# EAGLE design 12A-02 (EAGLE 6.3)
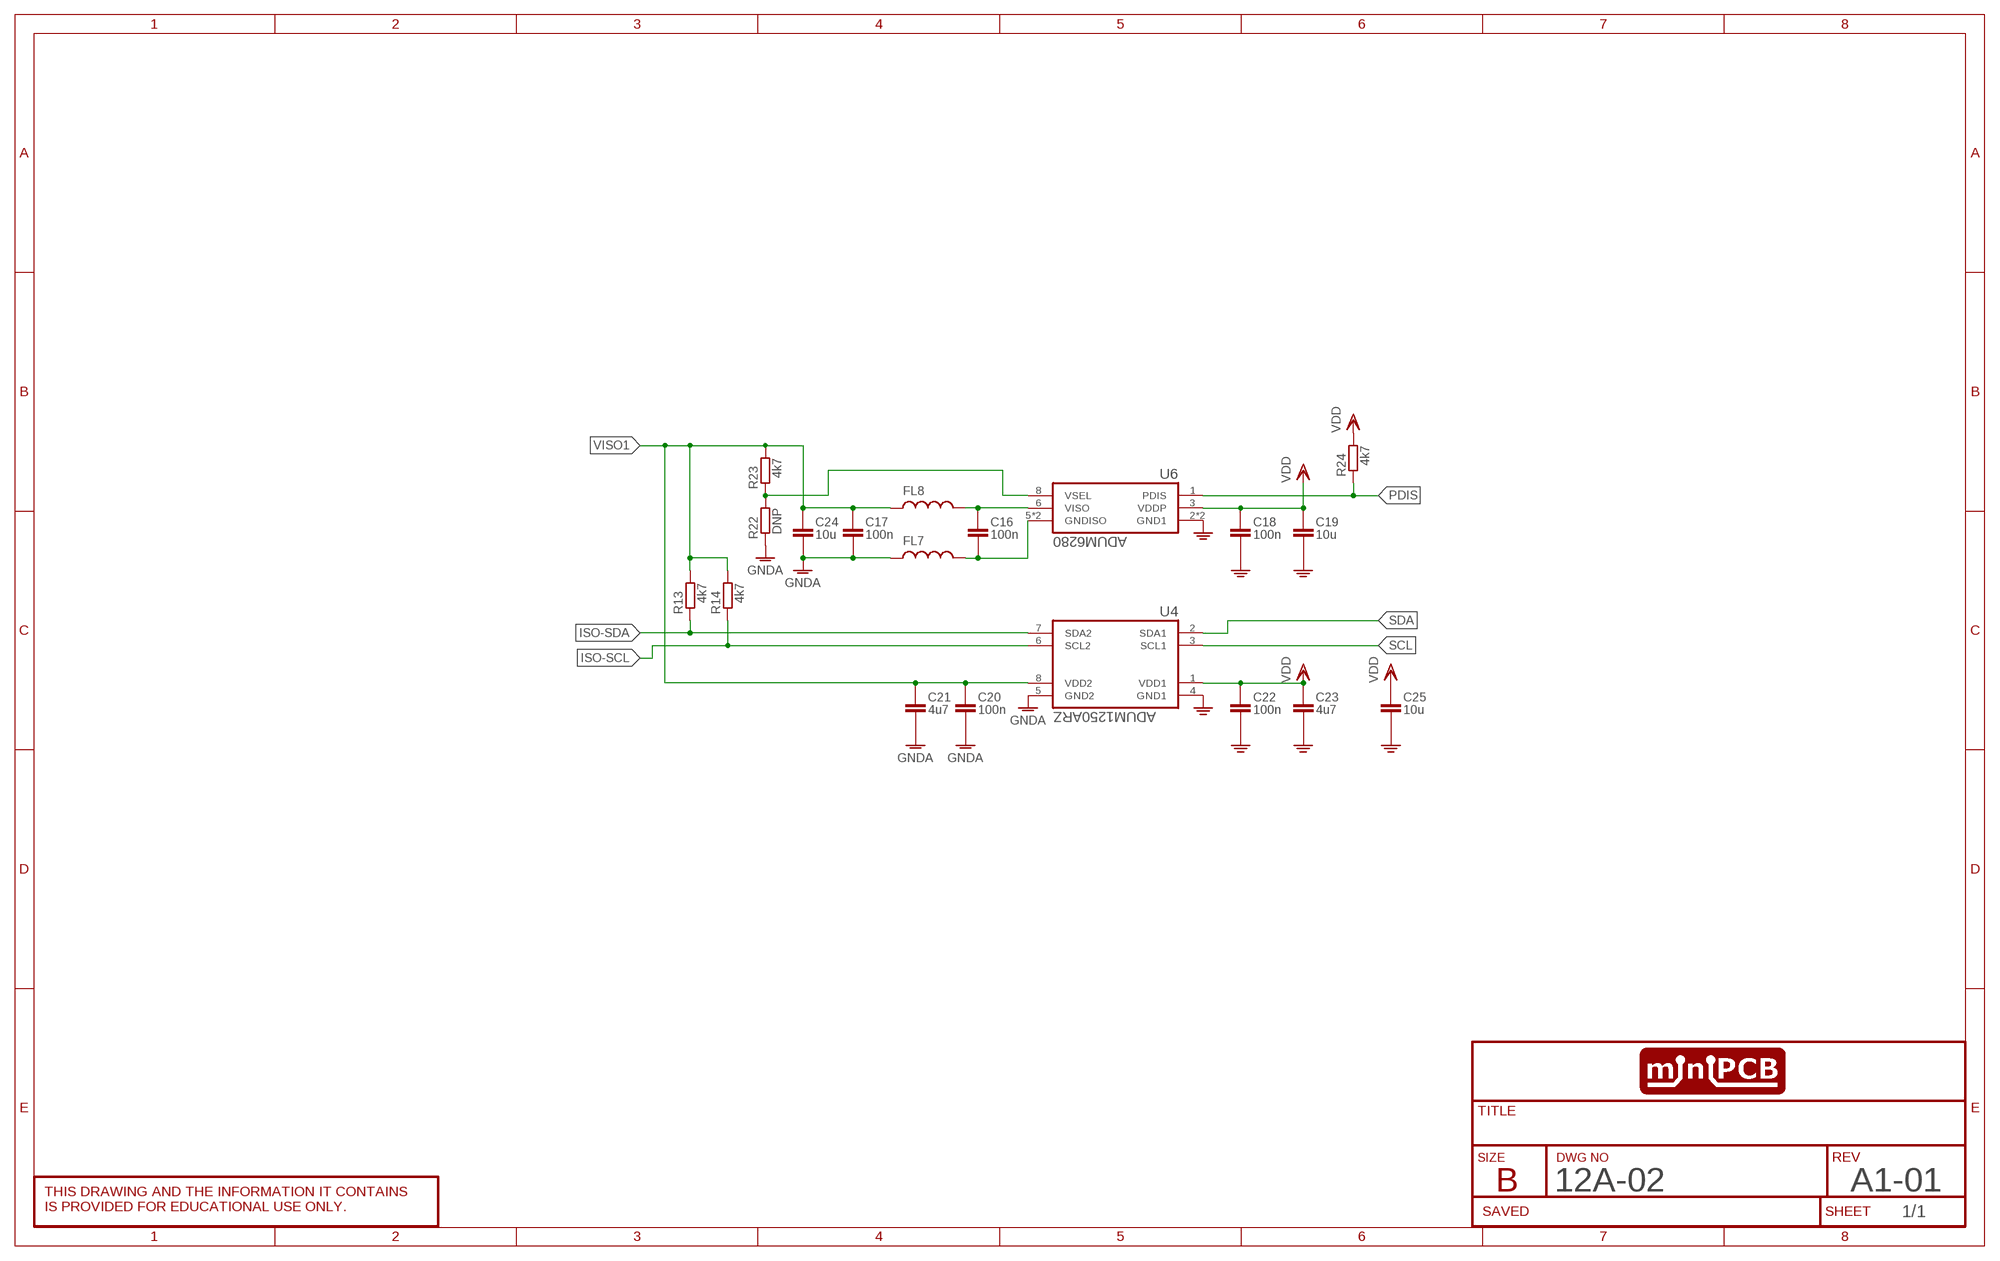
[diagram p0: schematic, sheet 1]
SHEET1 (SCHEMATIC): REV: A1-01

## Parts
C16  100n  CAPACITOR0402  [C0402]
C17  100n  CAPACITOR0402  [C0402]
C18  100n  CAPACITOR0402  [C0402]
C19  10u  CAPACITORSMD  [C0805]
C20  100n  CAPACITOR0402  [C0402]
C21  4u7  CAPACITOR0402  [C0402]
C22  100n  CAPACITOR0402  [C0402]
C23  4u7  CAPACITOR0402  [C0402]
C24  10u  CAPACITORSMD  [C0805]
C25  10u  CAPACITORSMD  [C0805]
FL7  BLM03HG601SZ1D  [R0402]
FL8  BLM03HG601SZ1D  [R0402]
R13  4k7  RESISTOR0402  [R0402]
R14  4k7  RESISTOR0402  [R0402]
R22  DNP  RESISTOR0402  [R0402]
R23  4k7  RESISTOR0402  [R0402]
R24  4k7  RESISTOR0402  [R0402]
U4  ADUM1250ARZ  [SOIC127P600X175-8N]
U6  ADUM6280  [SOIC127P600X175-8N]

## Nets
GND: C18.2(-) C19.2ASDF(-) C22.2(-) C23.2(-) C25.2ASDF(-) U4.4(GND1) U6.2(GND1) U6.4(GND1)
GNDA: C17.2(-) C20.2(-) C21.2(-) C24.2ASDF(-) FL7.1 R22.1 U4.5(GND2)
ISO-SCL: R14.1 U4.6(SCL2)
ISO-SDA: R13.1 U4.7(SDA2)
N$22: R22.2 R23.1 U6.8(VSEL)
N$23: C16.2(-) FL7.2 U6.5(GNDISO) U6.7(GNDISO)
N$24: C16.1(+) FL8.2 U6.6(VISO)
PDIS: R24.1 U6.1(PDIS)
SCL: U4.3(SCL1)
SDA: U4.2(SDA1)
VDD: C18.1(+) C19.1ASD(+) C22.1(+) C23.1(+) C25.1ASD(+) R24.2 U4.1(VDD1) U6.3(VDDP)
VISO1: C17.1(+) C20.1(+) C21.1(+) C24.1ASD(+) FL8.1 R13.2 R14.2 R23.2 U4.8(VDD2)

## Library data of the parts
C16-C25 = minipcb:CAPACITOR
FL7 FL8 = minipcb:BLM03HG601SZ1D: Check availability <https://pricing.snapeda.com/parts/BLM03HG601SZ1D/Murata/view-part?ref=eda>
R13 R14 R22-R24 = minipcb:RESISTOR
U4 = 16A-01:ADUM1250ARZ: Hot Swappable, Dual I2C Isolators Check availability <https://pricing.snapeda.com/parts/ADUM1250ARZ/Analog%20Devices/view-part?ref=eda>; AVAILABILITY: In Stock; CHECK_PRICES: https://www.snapeda.com/parts/ADUM1250ARZ/Analog+Devices/view-part/?ref=eda; DESCRIPTION: Hot Swappable Dual I2C Isolator; MF: Analog Devices; MP: ADUM1250ARZ; PACKAGE: SOIC-8 Analog Devices; PRICE: None; SNAPEDA_LINK: https://www.snapeda.com/parts/ADUM1250ARZ/Analog+Devices/view-part/?ref=snap
U6 = 16A-01:ADUM6280

## Board
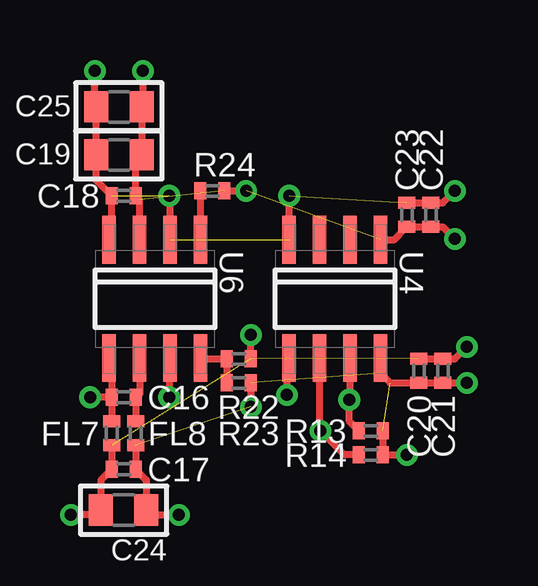
[diagram p1: board, top side]
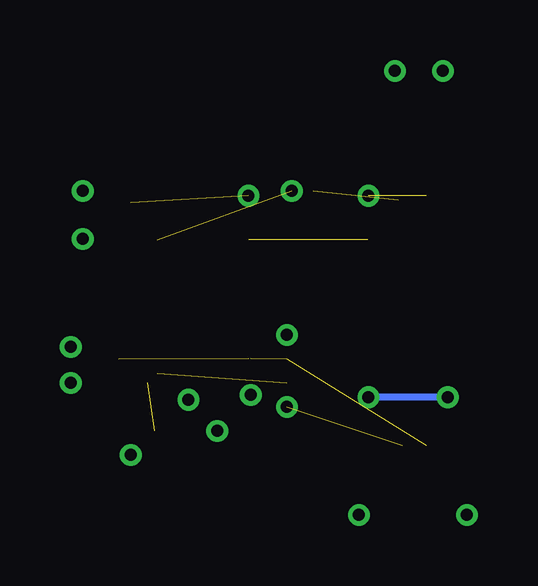
[diagram p2: board, bottom side, seen from below]

No outline drawn. Coordinates in mm, seen from the top.
Copper layers (1*16): Top 0.035mm / dielectric 1.5mm / Bottom 0.035mm
Design rules "default": minimum track width 10mil, minimum drill 0.6mm, track to track 8mil, track to pad 8mil, pad to pad 8mil, via to via 8mil, smd to smd 8mil, copper to edge 40mil, drill to drill 8mil, minimum pad ring 10mil, minimum via ring 8mil, stop-mask expansion 4mil, vias tented up to drill 0mil, thermal gap 10mil

### Footprints (pad centres in the part's own frame; a part is rotated, then mirrored left to right if it is on the bottom)
C0402 = smd 0.5 x 0.7: 1 -0.5,0; 2 0.5,0
C0805 = smd 1 x 1.3: 1ASD -0.95,0; 2ASDF 0.95,0
R0402 = smd 0.5 x 0.7: 1 -0.5,0; 2 0.5,0
SOIC127P600X175-8N = smd 1.981 x 0.559: 1 -2.464,1.905; 2 -2.464,0.635; 3 -2.464,-0.635; 4 -2.464,-1.905; 5 2.464,-1.905; 6 2.464,-0.635; 7 2.464,0.635; 8 2.464,1.905

### Placement (x,y rotation side)
C16  -8.8,-4.1 180 top
C17  -8.8,-7.1 180 top
C18  -8.8,4.3 180 top
C19  -9,6 180 top
C20  3.5,-3 90 top
C21  4.5,-3 90 top
C22  4,3.5 90 top
C23  3,3.5 90 top
C24  -8.8,-8.8 180 top
C25  -9,8 180 top
FL7  -9.3,-5.6 90 top
FL8  -8.3,-5.6 90 top
R13  1.5,-5.5 0 top
R14  1.5,-6.5 0 top
R22  -4,-2.5 180 top
R23  -4,-3.5 0 top
R24  -5.1,4.5 0 top
U4  0,0 270 top
U6  -7.5,0 270 top

### Tracks (layer width: path | path; a pad name or v marks a point on that pad's centre or on a via)
GND  (via drill 0.5)  (3 unrouted)
  Top 0.3: U6.4 -9.3,2.46 C18.2 -9.95,4.95 C19.2ASDF C25.2ASDF -10,8.05 v-10,9.5 | U6.2 -6.87,4.26 v-6.9,4.3 | U4.4 v-1.91,4.29 v-1.9,4.3 | C23.2 C22.2 4.5,4 v5,4.5
GNDA  (via drill 0.5)  (3 unrouted)
  Top 0.3: v-11,-9 -9.95,-9 C24.2ASDF -9.75,-7.55 C17.2 FL7.1 | R22.1 v-3.5,-1.5 | U4.5 -2,-2.46 v-2,-4 | C20.2 C21.2 5,-2.5 v5.5,-2
ISO-SCL  (via drill 0.5)
  Top 0.3: R14.1 0.4,-6.5 v-0.6,-5.5 -0.64,-5.46 U4.6
ISO-SDA  (via drill 0.5)
  Top 0.3: R13.1 0.6,-5.1 v0.6,-4.2 0.64,-4.17 U4.7
N$22
  Top 0.3: U6.8 -5.56,-2.5 R22.2 R23.1
N$23  (via drill 0.5)
  Top 0.3: U6.5 -9.3,-2.57 C16.2 | C16.2 FL7.2 | v-6.9,-4.1 -6.9,-2.5 U6.7 | C16.2 v-10.2,-4.1
  Bottom 0.3: v-10.2,-4.1 v-6.9,-4.1
N$24
  Top 0.3: U6.6 -8.13,-3.94 arc-90 C16.1 FL8.2
PDIS
  Top 0.3: U6.1 R24.1
VDD  (via drill 0.5)  (2 unrouted)
  Top 0.3: v-8,9.5 -8,8.05 arc-90 C25.1ASD C19.1ASD arc90 -8.3,5.75 C18.1 -8.13,4.13 U6.3 | R24.2 v-3.7,4.5 | U4.1 2.46,2.46 C23.1 C22.1 4.5,3 v5,2.5
VISO1  (via drill 0.5)  (3 unrouted)
  Top 0.3: FL8.1 C17.1 -7.85,-7.55 C24.1ASD -7.65,-9 v-6.5,-9 | R23.2 v-3.5,-4.5 | U4.8 1.91,-3.1 2.3,-3.5 C20.1 C21.1 v5.5,-3.5 | R13.2 R14.2 v3,-6.5